# Altium schematic sheet monitor.SchDoc
size A4
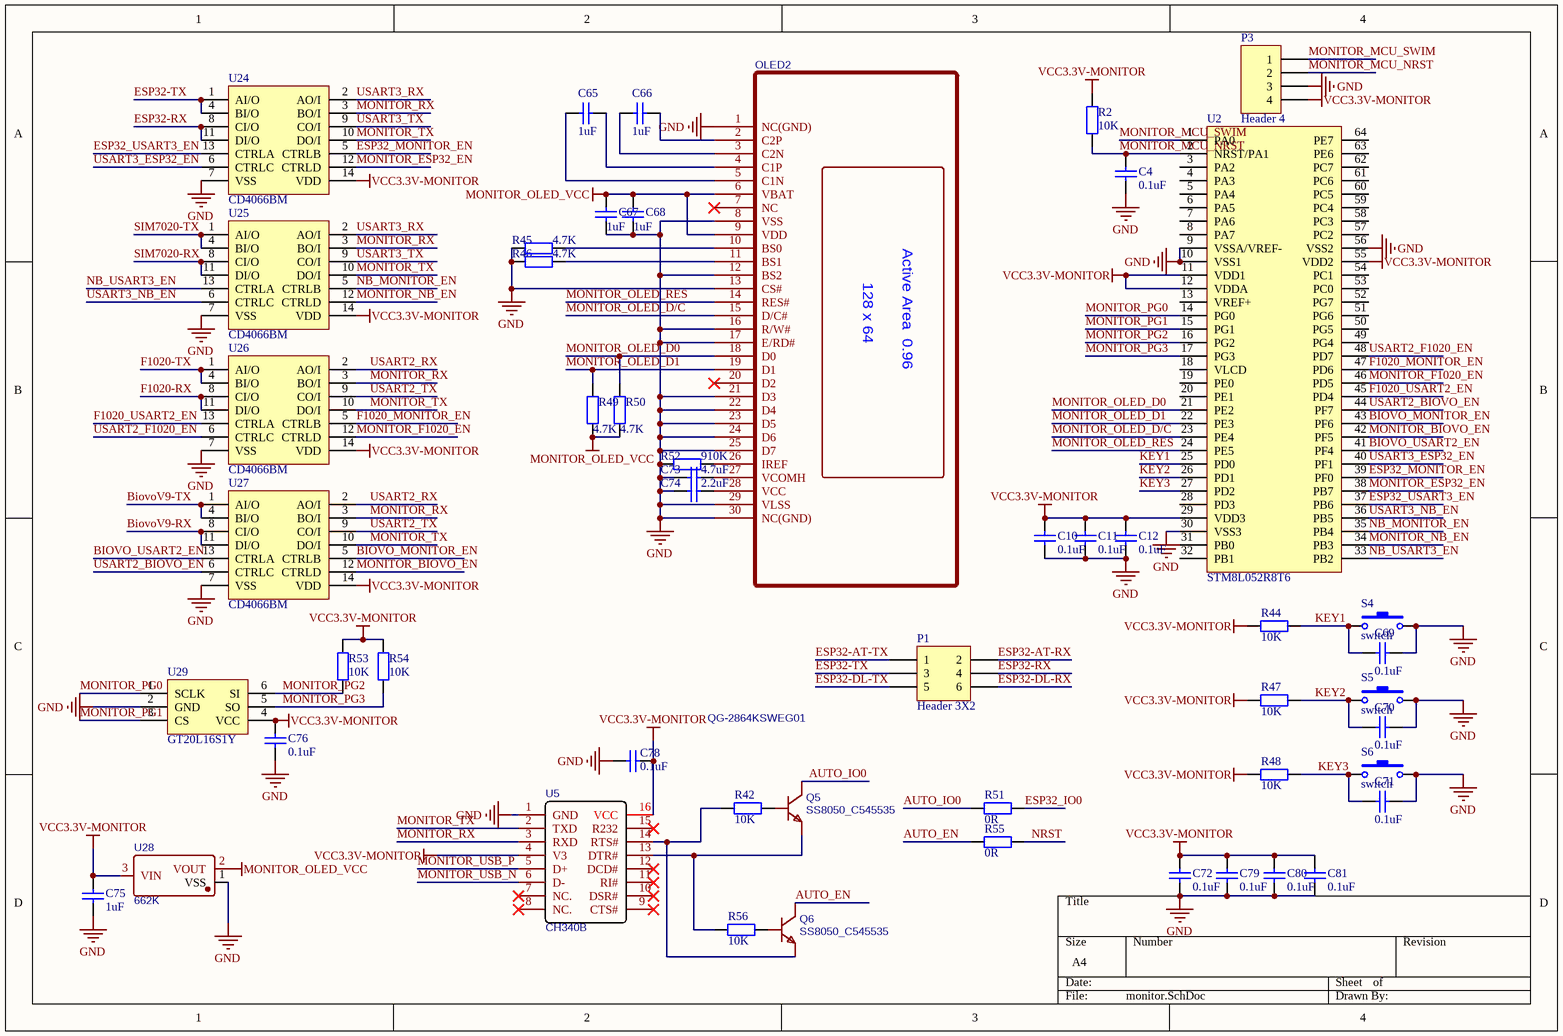
[diagram p0: monitor.SchDoc]

## Parts
C4  0.1uF  [0603_C]
C10  0.1uF  [0603_C]
C11  0.1uF  [0603_C]
C12  0.1uF  [0603_C]
C65  1uF  [0603_C]
C66  1uF  [0603_C]
C67  1uF  [0603_C]
C68  1uF  [0603_C]
C69  0.1uF  [0603_C]
C70  0.1uF  [0603_C]
C71  0.1uF  [0603_C]
C72  0.1uF  [0603_C]
C73  4.7uF  [0603_C]
C74  2.2uF  [0603_C]
C75  1uF  [0603_C]
C76  0.1uF  [0603_C]
C78  0.1uF  [0603_C]
C79  0.1uF  [0603_C]
C80  0.1uF  [0603_C]
C81  0.1uF  [0603_C]
OLED2  QG-2864KSWEG01  [OLED-SMD_QG-2864KSWEG01-flod]
P1  Header 3X2  [HDR2X3]
P3  Header 4  [HDR1X4]
Q5  SS8050_C545535  [SOT-23-3_L2.9-W1.3-P1.90-LS2.4-BR]
Q6  SS8050_C545535  [SOT-23-3_L2.9-W1.3-P1.90-LS2.4-BR]
R2  10K  [0603_R]
R42  10K  [0603_R]
R44  10K  [0603_R]
R45  4.7K  [0603_R]
R46  4.7K  [0603_R]
R47  10K  [0603_R]
R48  10K  [0603_R]
R49  4.7K  [0603_R]
R50  4.7K  [0603_R]
R51  0R  [0603_R]
R52  910K  [0603_R]
R53  10K  [0603_R]
R54  10K  [0603_R]
R55  0R  [0603_R]
R56  10K  [0603_R]
S4  switch  [SW-SMD_4P-L6.2-W6.2-P4.50-LS9.0]
S5  switch  [SW-SMD_4P-L6.2-W6.2-P4.50-LS9.0]
S6  switch  [SW-SMD_4P-L6.2-W6.2-P4.50-LS9.0]
U2  STM8L052R8T6  [LQFP-64_10X10X05P]
U5  CH340B  [SOP-16_L10.0-W3.9-P1.27-LS6.0-BL]
U24  CD4066BM  [SOIC-14_L8.7-W3.9-P1.27-LS6.0-BL]
U25  CD4066BM  [SOIC-14_L8.7-W3.9-P1.27-LS6.0-BL]
U26  CD4066BM  [SOIC-14_L8.7-W3.9-P1.27-LS6.0-BL]
U27  CD4066BM  [SOIC-14_L8.7-W3.9-P1.27-LS6.0-BL]
U28  662K  [SOT-23(SOT-23-3)]
U29  GT20L16S1Y  [SOT-23-6]

## Nets
GND: C4.1 C10.1 C11.1 C12.1 C67.2 C68.2 C69.1 C70.1 C71.1 C72.1 C73.1 C74.1 C75.2 C76.1 C78.1 C79.1 C80.1 C81.1 OLED2.1(NC(GND)) OLED2.8(VSS) OLED2.12(BS2) OLED2.13(CS#) OLED2.16(R/W#) OLED2.17(E/RD#) OLED2.21(D3) OLED2.22(D4) OLED2.23(D5) OLED2.24(D6) OLED2.25(D7) OLED2.29(VLSS) OLED2.30(NC(GND)) P3.3 R45.1 R46.1 R52.2 S4.2 S5.2 S6.2 U2.9(VSSA/VREF-) U2.10(VSS1) U2.30(VSS3) U2.56(VSS2) U5.1(GND) U24.7(VSS) U25.7(VSS) U26.7(VSS) U27.7(VSS) U28.1(VSS) U29.2(GND)
MONITOR_OLED_VCC: C67.1 C68.1 OLED2.6(VBAT) OLED2.9(VDD) R49.1 R50.1 U28.2(VOUT)
VCC3.3V-MONITOR: C10.2 C11.2 C12.2 C72.2 C75.1 C76.2 C78.2 C79.2 C80.2 C81.2 P3.4 R2.2 R44.2 R47.2 R48.2 R53.2 R54.2 U2.11(VDD1) U2.12(VDDA) U2.29(VDD3) U2.55(VDD2) U5.4(V3) U5.16(VCC) U24.14(VDD) U25.14(VDD) U26.14(VDD) U27.14(VDD) U28.3(VIN) U29.4(VCC)
AUTO_EN: Q6.3(C) R55.2
AUTO_IO0: Q5.3(C) R51.2
BIOVO_MONITOR_EN: U2.43(PF6) U27.5(CTRLB)
BIOVO_USART2_EN: U2.41(PF4) U27.13(CTRLA)
BiovoV9-RX: U27.8(CI/O) U27.11(DI/O)
BiovoV9-TX: U27.1(AI/O) U27.4(BI/O)
ESP32-AT-RX: P1.2
ESP32-AT-TX: P1.1
ESP32-DL-RX: P1.6
ESP32-DL-TX: P1.5
ESP32-RX: P1.4 U24.8(CI/O) U24.11(DI/O)
ESP32-TX: P1.3 U24.1(AI/O) U24.4(BI/O)
ESP32_IO0: R51.1
ESP32_MONITOR_EN: U2.39(PF0) U24.5(CTRLB)
ESP32_USART3_EN: U2.37(PB6) U24.13(CTRLA)
F1020-RX: U26.8(CI/O) U26.11(DI/O)
F1020-TX: U26.1(AI/O) U26.4(BI/O)
F1020_MONITOR_EN: U2.47(PD6) U26.5(CTRLB)
F1020_USART2_EN: U2.45(PD4) U26.13(CTRLA)
KEY1: C69.2 R44.1 S4.1 U2.25(PD0)
KEY2: C70.2 R47.1 S5.1 U2.26(PD1)
KEY3: C71.2 R48.1 S6.1 U2.27(PD2)
MONITOR_BIOVO_EN: U2.42(PF5) U27.12(CTRLD)
MONITOR_ESP32_EN: U2.38(PB7) U24.12(CTRLD)
MONITOR_F1020_EN: U2.46(PD5) U26.12(CTRLD)
MONITOR_MCU_NRST: C4.2 P3.2 R2.1 U2.2(NRST/PA1)
MONITOR_MCU_SWIM: P3.1 U2.1(PA0)
MONITOR_NB_EN: U2.34(PB3) U25.12(CTRLD)
MONITOR_OLED_D0: OLED2.18(D0) R50.2 U2.21(PE2)
MONITOR_OLED_D1: OLED2.19(D1) R49.2 U2.22(PE3)
MONITOR_OLED_D/C: OLED2.15(D/C#) U2.23(PE4)
MONITOR_OLED_RES: OLED2.14(RES#) U2.24(PE5)
MONITOR_PG0: U2.14(PG0) U29.1(SCLK)
MONITOR_PG1: U2.15(PG1) U29.3(CS)
MONITOR_PG2: R53.1 U2.16(PG2) U29.6(SI)
MONITOR_PG3: R54.1 U2.17(PG3) U29.5(SO)
MONITOR_RX: U5.3(RXD) U24.3(BO/I) U25.3(BO/I) U26.3(BO/I) U27.3(BO/I)
MONITOR_TX: U5.2(TXD) U24.10(DO/I) U25.10(DO/I) U26.10(DO/I) U27.10(DO/I)
MONITOR_USB_N: U5.6(D-)
MONITOR_USB_P: U5.5(D+)
NB_MONITOR_EN: U2.35(PB4) U25.5(CTRLB)
NB_USART3_EN: U2.33(PB2) U25.13(CTRLA)
NRST: R55.1
SIM7020-RX: U25.8(CI/O) U25.11(DI/O)
SIM7020-TX: U25.1(AI/O) U25.4(BI/O)
USART2_BIOVO_EN: U2.44(PF7) U27.6(CTRLC)
USART2_F1020_EN: U2.48(PD7) U26.6(CTRLC)
USART2_RX: U26.2(AO/I) U27.2(AO/I)
USART2_TX: U26.9(CO/I) U27.9(CO/I)
USART3_ESP32_EN: U2.40(PF1) U24.6(CTRLC)
USART3_NB_EN: U2.36(PB5) U25.6(CTRLC)
USART3_RX: U24.2(AO/I) U25.2(AO/I)
USART3_TX: U24.9(CO/I) U25.9(CO/I)
NetC65_1: C65.1 OLED2.4(C1P)
NetC65_2: C65.2 OLED2.5(C1N)
NetC66_1: C66.1 OLED2.2(C2P)
NetC66_2: C66.2 OLED2.3(C2N)
NetC73_2: C73.2 OLED2.27(VCOMH)
NetC74_2: C74.2 OLED2.28(VCC)
NetOLED2_10: OLED2.10(BS0) R45.2
NetOLED2_11: OLED2.11(BS1) R46.2
NetOLED2_26: OLED2.26(IREF) R52.1
NetQ5_1: Q5.1(B) R42.1
NetQ5_2: Q5.2(E) R56.2 U5.13(DTR#)
NetQ6_1: Q6.1(B) R56.1
NetQ6_2: Q6.2(E) R42.2 U5.14(RTS#)

Not connected (* = marked no-connect by the designer): OLED2 7(NC)* 20(D2)*; U2 3(PA2) 4(PA3) 5(PA4) 6(PA5) 7(PA6) 8(PA7) 13(VREF+) 18(VLCD) 19(PE0) 20(PE1) 28(PD3) 31(PB0) 32(PB1) 49(PG4) 50(PG5) 51(PG6) 52(PG7) 53(PC0) 54(PC1) 57(PC2) 58(PC3) 59(PC4) 60(PC5) 61(PC6) 62(PC7) 63(PE6) 64(PE7); U5 7(NC.)* 8(NC.)* 9(CTS#)* 10(DSR#)* 11(RI#)* 12(DCD#)* 15(R232)*

## Notes on the sheet
- (in symbol QG-2864KSWEG01) Active Area  0.96; 128 x 64

## Library data of the parts
C4 C10-C12 C65-C76 C78-C81 = Cap: 贴片电容，0603
OLED2 = QG-2864KSWEG01: 128x64 单色白色，QG-2864KSWEG01; BOM_Manufacturer: Allvision; BOM_Supplier: LCSC; BOM_Manufacturer Part: QG-2864KSWEG01; BOM_Supplier Part: C85007; spicePre: O; spiceSymbolName: QG-2864KSWEG01
P1 = Header 3X2: Header, 3-Pin, Dual row; LatestRevisionDate: 17-Jul-2002; LatestRevisionNote: Re-released for DXP Platform.; Publisher: Altium Limited
P3 = Header 4: 不焊; LatestRevisionDate: 17-Jul-2002; LatestRevisionNote: Re-released for DXP Platform.; Publisher: Altium Limited
Q5 Q6 = SS8050_C545535: S8050,SOT-23
R2 R42 R44-R56 = Res2: 贴片电阻，0603
S4-S6 = switch: 贴片按键，6*6*5
U2 = STM8L052R8T6: STM8L052R8T6,LQFP-64_10x10x05P
U5 = CH340C: CH340B,SOP-16_150mil
U24-U27 = CD4066B: 双向 FET 开关,CD4066BM,SOIC-14
U28 = 662K: 线性稳压器662k,SOT23-3
U29 = GT20L16S1Y: 字库芯片， SOT-23-6